# Altium schematic sheet HighPassFilter.SchDoc
size A; SheetNumber: 3; SheetTotal: 5
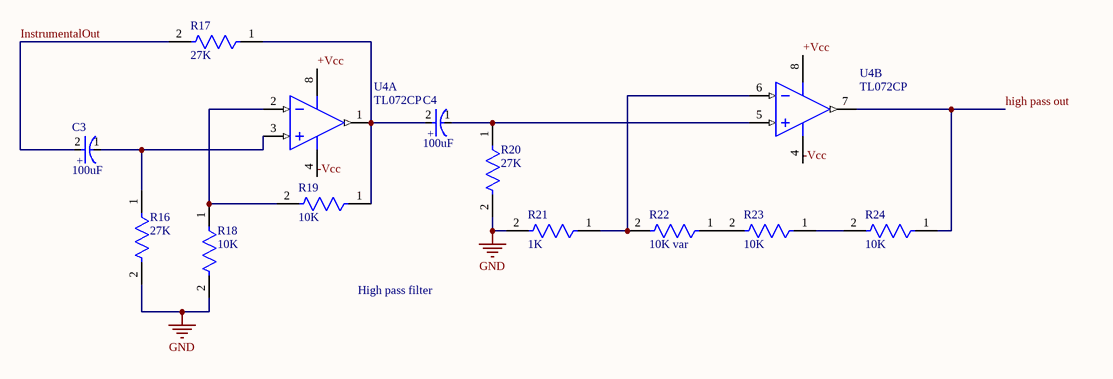
[diagram p0: HighPassFilter.SchDoc]

## Parts
C3  100uF  [FP-RAD-TH-D_6_3_0_5-L_11-MFG]
C4  100uF  [FP-RAD-TH-D_6_3_0_5-L_11-MFG]
R16  27K  [FP-CFR-25-MFG]
R17  27K  [FP-CFR-25-MFG]
R18  10K  [FP-CFR-25-MFG]
R19  10K  [FP-CFR-25-MFG]
R20  27K  [FP-CFR-25-MFG]
R21  1K  [FP-CFR-25-MFG]
R22  10K var  [FP-CFR-25-MFG]
R23  10K  [FP-CFR-25-MFG]
R24  10K  [FP-CFR-25-MFG]
U4  TL072CP  [P0008A]  (parts A,B of 2)

## Nets
GND: R16.2 R18.2 R20.2 R21.2
+Vcc: U4.8(VCC+)
-Vcc: U4.4(VCC-)
high pass out: R24.1 U4.7(OUT2)
InstrumentalOut: C3.2(A) R17.2
NetC3_1: C3.1(C) R16.1 U4.3(IN1+)
NetC4_1: C4.1(C) R20.1 U4.5(IN2+)
NetC4_2: C4.2(A) R17.1 R19.1 U4.1(OUT1)
NetR18_1: R18.1 R19.2 U4.2(IN1-)
NetR21_1: R21.1 R22.2 U4.6(IN2-)
NetR22_1: R22.1 R23.2
NetR23_1: R23.1 R24.2

## Notes on the sheet
- High pass filter
- (in symbol CMP-05427-000237-1) +

## Library data of the parts
C3 C4 = CMP-05427-000237-1: Aluminum Electrolytic Capacitors (Radial Lead Type) 4.7uF ±20% 160V; Life (Hours): 2000Hour; Ripple Current: 43mA; Dielectric Material: Aluminium; Lead/Base Style: Straight; Lead Diameter: 0.5mm; Dissipation Factor: 0.15%; Height - Seated (Max): 0.48inch; Voltage: 160V; REACH SVHC: No SVHC; Package Quantity: 200; Length: 11.2mm; Termination: Radial; Weight: 0.01lb; Construction: RADIAL; Voltage Rating (DC): 160V; Number of Pins: 2; Voltage Rating: 160V; Min Operating Temperature: -25°C; Packaging: Bulk; Radiation Hardening: No; Series: NHG; Max Operating Temperature: 105°C; Height: 11.2mm; Mount: Through Hole; Tolerance: 20%; Capacitance: 4.7uF; Width: 0.25inch; Lead Pitch: 2.5mm; Diameter: 6.3mm; Ripple Current (AC): 43mA; Case/Package: Radial; Lead Free: Lead Free; RoHS Compliant: Yes
R16-R24 = CMP-03413-000009-1: RES 10 OHM 1/4W 5% AXIAL; Resistance: 10R; Temperature Coefficient: 500ppm/°C; Max Power Dissipation: 250mW; RoHS Compliant: Yes; Packaging: Bulk; Series: Carbon Film; Case/Package: Axial; Max Operating Temperature: 155°C; Min Operating Temperature: -55°C; Number of Terminations: 2; Length: 0.248inch; Resistor Type: Carbon Film; Tolerance: 5%; Package Quantity: 200
U4 = CMP-0017-00950-2: Dual Low-Noise JFET-Input General-Purpose Operational Amplifier, 7 to 36 V, 0 to 70 degC, 8-pin DIP (P8), Pb-Free (RoHS); Manufacturer: Texas Instruments; Sub Family: General Purpose Amplifier, High Supply Voltage Amplifier (>=30V); Total Supply Voltage(Max)(+5V is 5, +/-5V is 10): 36; Slew Rate(Typ)(V/us): 13; Vn at 1kHz(Typ)(nV/rtHz): 18; GBW(Typ)(MHz): 3; CMRR(Min)(dB): 70; Total Supply Voltage(Min)(+5V is 5, +/-5V is 10): 7; Vio (25C)(Max)(mV): 10; Rating: Catalog; IIB(Max)(pA): 200; Iq per channel(Max)(mA): 2.5; Number of Channels: 2; Mounting Technology: Through Hole; ComponentLink3Description: Package Specification; PartNumber: TL072CP; PackageVersion: 4040082/E, 04/2010; Eco-Plan: Pb-Free (RoHS); DatasheetVersion: SLOS080J; Offset Drift(Typ)(uV/C): 18; ComponentLink3URL: http://www.ti.com/litv/pdf/mpdi001b; PackageDescription: 8-Pin Plastic In-Line, Body 9.59 x 6.35 mm, Pitch 2.54 mm; Code_JEDEC: MS-001; ComponentLink2URL: http://www.ti.com/lit/ds/symlink/tl072.pdf; ComponentLink1Description: Manufacturer URL; ComponentLink2Description: Datasheet; ComponentLink1URL: http://www.ti.com/; PackageReference: P0008A